# EAGLE design sixties2 (EAGLE 7.1.0)
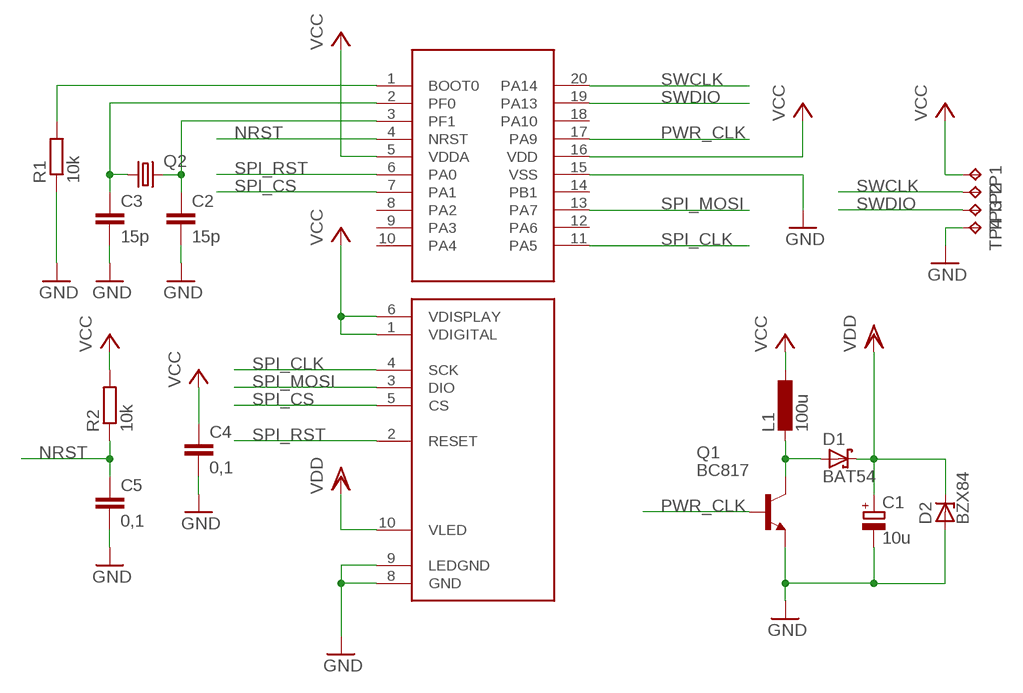
[diagram p0: schematic, sheet 1]

## Parts
C1  10u  CPOL-EUD/7343-31W  [D/7343-31W]
C2  15p  C-EUC0805K  [C0805K]
C3  15p  C-EUC0805K  [C0805K]
C4  0,1  C-EUC0805K  [C0805K]
C5  0,1  C-EUC0805K  [C0805K]
D1  BAT54  [SOT23]
D2  BZX84  BZX84CSMD  [TO236]
L1  100u  L-EUL1812  [L1812]
Q1  BC817  BC817-40SMD  [SOT23-BEC]
Q2  CRYSTALSM49  [SM49]
R1  10k  R-EU_M0805  [M0805]
R2  10k  R-EU_M0805  [M0805]
TP1  TPTP11R  [TP11R]
TP2  TPTP11R  [TP11R]
TP3  TPTP11R  [TP11R]
TP4  TPTP11R  [TP11R]
U1  STM32F030F4  [TSSOP20]
U$2  NOKIA6100_LCD  [NOKIA6100_LCD]

## Nets
GND: C1.- C2.2 C3.2 C4.2 C5.2 D2.A Q1.E R1.1 TP4.TP U1.15(VSS) U$2.8(GND) U$2.9(LEDGND)
N$1: D1.1(A) L1.2 Q1.C
N$2: C3.1 Q2.1 U1.2(PF0)
N$3: C2.1 Q2.2 U1.3(PF1)
N$4: R1.2 U1.1(BOOT0)
NRST: C5.1 R2.1 U1.4(NRST)
PWR_CLK: Q1.B U1.17(PA9)
SPI_CLK: U1.11(PA5) U$2.4(SCK)
SPI_CS: U1.7(PA1) U$2.5(CS)
SPI_MOSI: U1.13(PA7) U$2.3(DIO)
SPI_RST: U1.6(PA0) U$2.2(RESET)
SWCLK: TP2.TP U1.20(PA14)
SWDIO: TP3.TP U1.19(PA13)
VCC: C4.1 L1.1 R2.2 TP1.TP U1.5(VDDA) U1.16(VDD) U$2.1(VDIGITAL) U$2.6(VDISPLAY)
VDD: C1.+ D1.3(C) D2.C U$2.10(VLED)
Unconnected: U1.8(PA2) U1.9(PA3) U1.10(PA4) U1.12(PA6) U1.14(PB1) U1.18(PA10)

## Library data of the parts
C1 = rcl:CPOL-EU: POLARIZED CAPACITOR, European symbol
C2-C5 = rcl:C-EU: CAPACITOR, European symbol
D1 = diode:BAT54: Schottky Diodes Source: Fairchild .. BAT54.pdf
D2 = diode:BZX84CSMD: Z DIODE
L1 = rcl:L-EU: INDUCTOR, European symbol
Q1 = transistor-npn:BC817*: NPN Transistor
Q2 = crystal:CRYSTAL: CRYSTAL; OC_FARNELL: unknown; OC_NEWARK: unknown
R1 R2 = rcl:R-EU_: RESISTOR, European symbol
TP1-TP4 = testpad:TP: Test pad
U1 = stm32xx:STM32F030F4
U$2 = nokia_6100:NOKIA6100_LCD

## Board
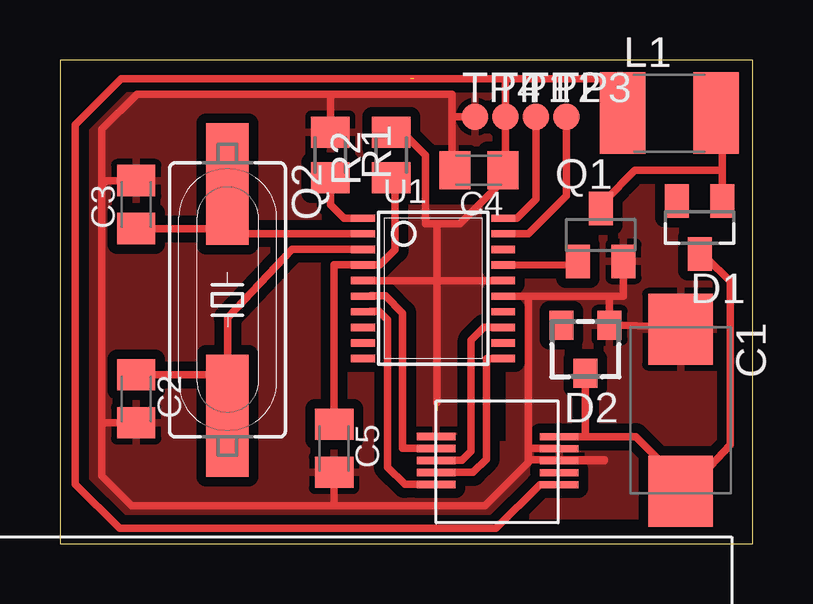
[diagram p1: board, top side]

Size 28.88 x 20.15 mm. Coordinates in mm from the lower left corner, seen from the top.
Outline: 0,0 28.88,0 28.88,20.15 0,20.15 0,0
Copper layers (1*16): Top 0.035mm / dielectric 1.5mm / Bottom 0.035mm
Design rules "default": minimum track width 10mil, minimum drill 24mil, track to track 8mil, track to pad 8mil, pad to pad 8mil, via to via 8mil, smd to smd 8mil, copper to edge 40mil, drill to drill 8mil, minimum pad ring 10mil, minimum via ring 8mil, stop-mask expansion 4mil, vias tented up to drill 0mil, thermal gap 10mil

### Footprints (pad centres in the part's own frame; a part is rotated, then mirrored left to right if it is on the bottom)
D/7343-31W = smd 2.95 x 2.7: + 3.375,0; - -3.375,0
C0805K = smd 1.3 x 1.6: 1 -1,0; 2 1,0
SOT23 = smd 1 x 1.4: 1 -0.95,-1.1; 2 0.95,-1.1; 3 0,1.1
TO236 = smd 1 x 1.2: A -1,-1; C 0,1; NC 1,-1
L1812 = smd 1.9 x 3.4: 1 -1.95,0; 2 1.95,0
SOT23-BEC = smd 1 x 1.4: B -0.95,-1.1; C 0,1.1; E 0.95,-1.1
SM49 = smd 5.08 x 1.778: 1 -4.826,0; 2 4.826,0
M0805 = smd 1.3 x 1.6: 1 -0.95,0; 2 0.95,0
TP11R = smd 1.1 x 1.1: TP 0,0
TSSOP20 = smd 0.305 x 0.991: 1 -2.925,-2.918; 2 -2.275,-2.918; 3 -1.625,-2.918; 4 -0.975,-2.918; 5 -0.325,-2.918; 6 0.325,-2.918; 7 0.975,-2.918; 8 1.625,-2.918; 9 2.275,-2.918; 10 2.925,-2.918; 11 2.925,2.918; 12 2.275,2.918; 13 1.625,2.918; 14 0.975,2.918; 15 0.325,2.918; 16 -0.325,2.918; 17 -0.975,2.918; 18 -1.625,2.918; 19 -2.275,2.918; 20 -2.925,2.918
NOKIA6100_LCD = smd 1.6 x 0.3: 1 24.255,44.311; 2 24.255,43.811; 3 24.255,43.311; 4 24.255,42.811; 5 24.255,42.311; 6 29.389,42.303; 7 29.389,42.803; 8 29.389,43.303; 9 29.389,43.803; 10 29.389,44.303

### Placement (x,y rotation side)
C1  25.88,5.56 270 top
C2  3.18,6.03 270 top
C3  3.18,14.13 90 top
C4  17.46,15.56 180 top
C5  11.43,3.97 270 top
D1  26.67,13.18 180 top
D2  21.91,8.1 180 top
L1  25.4,17.94 0 top
Q1  22.54,12.86 0 top
Q2  6.98,10.16 270 top
R1  11.27,16.19 270 top
R2  13.81,16.19 90 top
TP1  18.57,17.78 0 top
TP2  19.84,17.78 0 top
TP3  21.11,17.78 0 top
TP4  17.3,17.78 0 top
U1  15.56,10.64 270 top
U$2  -8.57,-39.85 0 top

### Tracks (layer width: path | path; a pad name or v marks a point on that pad's centre or on a via)
GND
  Top 0.305: U1.15 19.53,10.31 | 19.53,10.31 19.53,3.97 | 19.53,3.97 19.53,3.49 | 19.53,3.49 19.53,3.4 17.72,1.59 11.43,1.59 | 20.82,3.97 U$2.9 20.8,3.97 19.53,3.97 | C1.- 26.19,9.04 23.02,9.1 D2.A 22.91,10.31 | 11.43,1.59 2.99,1.59 1.75,2.83 1.75,4.92 | 19.53,10.31 22.91,10.31 | Q1.E 23.49,10.31 22.91,10.31 | 16.35,16.19 16.35,15.76 C4.2 | 1.75,4.92 1.75,14.92 | 1.75,14.92 1.75,17.27 3.21,18.73 11.27,18.73 | 11.27,18.73 R1.1 | C5.2 11.43,1.59 | 16.35,16.19 16.57,16.19 | C3.2 1.95,15.13 1.75,14.92 | C2.2 1.86,5.03 1.75,4.92 | 19.53,3.49 22.7,3.49 22.7,3.46 U$2.8 | 11.27,18.73 16.35,18.73 16.35,17.78 | 16.35,17.78 16.35,16.19 | TP4.TP 16.35,17.78
  pour Top (isolate 0.406): 18.41,20.16 0,20.16 0,0 28.89,0 28.89,15.4 22.38,15.4 22.38,11.59 18.73,11.59 18.73,4.13 13.65,4.13 13.65,8.25 11.91,8.25 11.91,15.87 18.41,15.87
N$1
  Top 0.305: D1.1 27.62,15.56 | Q1.C 22.69,14.28 23.97,15.56 27.62,15.56 | 27.62,15.56 27.62,17.94 L1.2
N$2
  Top 0.305: U1.2 6.98,12.91 6.98,13.18 | 6.98,13.18 Q2.1 | C3.1 6.94,13.13 6.98,13.18
N$3
  Top 0.305: U1.3 9.68,12.26 6.98,9.4 6.98,7.3 | 6.98,7.3 Q2.2 | C2.1 6.72,7.03 6.98,7.3
N$4
  Top 0.305: U1.1 11.84,13.56 11.27,14.13 R1.2
NRST
  Top 0.305: C5.1 11.43,11.61 U1.4 13.34,11.61 13.97,12.24 13.97,15.56 R2.1
PWR_CLK
  Top 0.305: U1.17 21.49,11.6 Q1.B
SPI_CLK
  Top 0.305: U$2.4 17.23,2.96 17.78,3.52 17.78,7.71 U1.11
SPI_CS
  Top 0.305: U$2.5 14.38,2.46 13.65,3.19 13.65,9.33 13.3,9.68 12.96,9.68 U1.7
SPI_MOSI
  Top 0.305: U$2.3 16.77,3.46 17.15,3.84 17.15,8.47 17.69,9.01 U1.13
SPI_RST
  Top 0.305: U$2.2 14.29,3.96 14.29,9.61 13.58,10.32 12.96,10.32 U1.6
SWCLK
  Top 0.305: U1.20 19.05,13.56 19.84,14.35 TP2.TP
SWDIO
  Top 0.305: U1.19 19.53,12.91 21.11,14.5 TP3.TP
VCC  (2 unrouted)
  Top 0.305: U$2.6 20,2.46 18.18,0.63 2.48,0.63 0.63,2.48 0.63,17.45 2.55,19.37 14.76,19.37 | 14.61,19.37 18.57,19.37 | 18.57,19.37 23.5,19.37 23.5,17.94 L1.1 | 18.58,15.56 C4.1 | C4.1 18.46,15.13 16.67,13.33 15.72,13.33 | R2.2 14.29,17.14 15.24,16.19 15.24,13.33 15.72,13.33 | 18.57,19.37 TP1.TP 18.57,15.56 C4.1 | U1.16 15.72,10.96 | 15.72,13.33 15.72,10.96 | 15.72,10.96 15.72,5.87 | U1.5 15.72,10.96
  pour Top (isolate 0.406): 12.86,13.97 18.1,13.97 18.1,4.6 12.86,4.6
VDD
  Top 0.305: U$2.10 21.91,4.46 | 21.91,4.46 24.01,4.46 26.04,2.43 C1.+ 26.04,2.06 27.94,4.13 27.94,10.92 26.94,11.92 D1.3 | D2.C 21.91,4.46